# EAGLE schematic untitled (EAGLE 9.0.1)
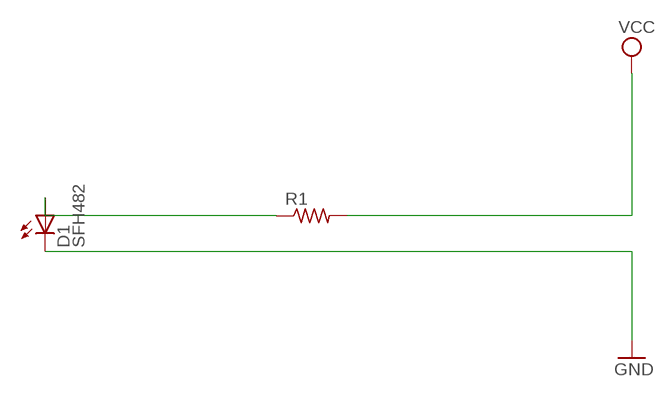
[diagram p0: schematic, sheet 1]

## Parts
D1  SFH482  [SFH482]
R1  R-US_0204/2V  [0204V]

## Nets
GND: D1.K(C)
N$1: D1.A R1.1
VCC: R1.2

## Library data of the parts
D1 = led:SFH482: IR LED infrared emitting diode, Infineon
R1 = resistor:R-US_: RESISTOR, American symbol